# EAGLE schematic barrieren-a-2 (EAGLE 9.6.2)
AUTHOR: Balazs Racz; DRAWING_TITLE: MEB Schalterwerk Projekt; LICENSE: Licensed by the Solderpad Hardware License V2.0; REVIEWER: n/a; REVISION: A5; YEAR: 2023
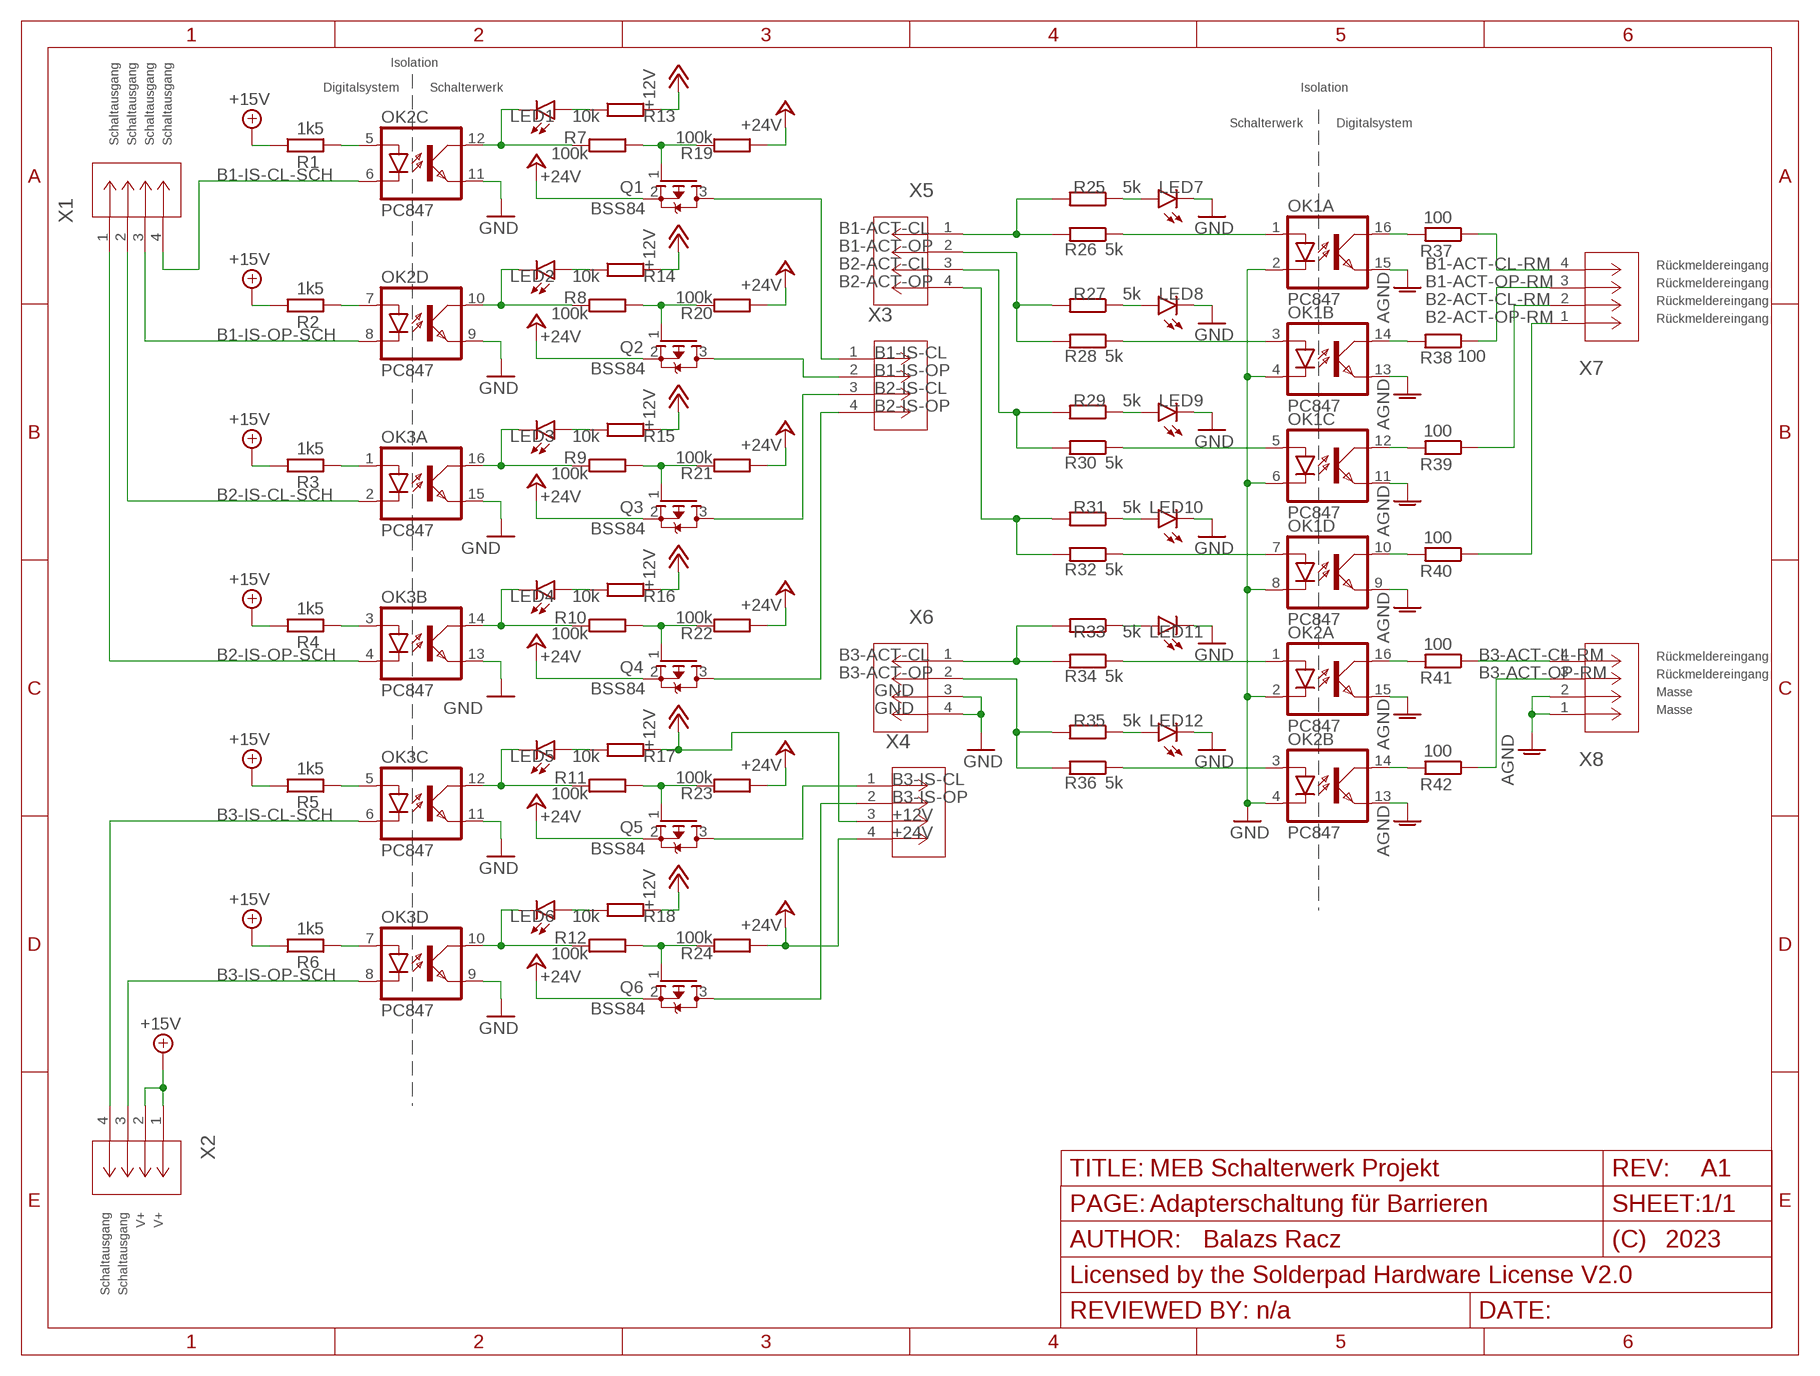
[diagram p0: schematic, sheet 1]
FRAME1 (FRAME_A_L): PAGE: Input ports
FRAME2 (FRAME_A_L): PAGE: Adapterschaltung für Barrieren; REVISION: A1

## Parts
LED1  LEDCHIPLED_0603  [CHIPLED_0603]
LED2  LEDCHIPLED_0603  [CHIPLED_0603]
LED3  LEDCHIPLED_0603  [CHIPLED_0603]
LED4  LEDCHIPLED_0603  [CHIPLED_0603]
LED5  LEDCHIPLED_0603  [CHIPLED_0603]
LED6  LEDCHIPLED_0603  [CHIPLED_0603]
LED7  LEDCHIPLED_0603  [CHIPLED_0603]
LED8  LEDCHIPLED_0603  [CHIPLED_0603]
LED9  LEDCHIPLED_0603  [CHIPLED_0603]
LED10  LEDCHIPLED_0603  [CHIPLED_0603]
LED11  LEDCHIPLED_0603  [CHIPLED_0603]
LED12  LEDCHIPLED_0603  [CHIPLED_0603]
OK1  PC847  [DIL16]
OK2  PC847  [DIL16]
OK3  PC847  [DIL16]
Q1  BSS84  [SOT23-PCH]
Q2  BSS84  [SOT23-PCH]
Q3  BSS84  [SOT23-PCH]
Q4  BSS84  [SOT23-PCH]
Q5  BSS84  [SOT23-PCH]
Q6  BSS84  [SOT23-PCH]
R1  1k5  R-EU_R0805  [R0805]
R2  1k5  R-EU_R0805  [R0805]
R3  1k5  R-EU_R0805  [R0805]
R4  1k5  R-EU_R0805  [R0805]
R5  1k5  R-EU_R0805  [R0805]
R6  1k5  R-EU_R0805  [R0805]
R7  100k  R-EU_R0805  [R0805]
R8  100k  R-EU_R0805  [R0805]
R9  100k  R-EU_R0805  [R0805]
R10  100k  R-EU_R0805  [R0805]
R11  100k  R-EU_R0805  [R0805]
R12  100k  R-EU_R0805  [R0805]
R13  10k  R-EU_R0805  [R0805]
R14  10k  R-EU_R0805  [R0805]
R15  10k  R-EU_R0805  [R0805]
R16  10k  R-EU_R0805  [R0805]
R17  10k  R-EU_R0805  [R0805]
R18  10k  R-EU_R0805  [R0805]
R19  100k  R-EU_R0805  [R0805]
R20  100k  R-EU_R0805  [R0805]
R21  100k  R-EU_R0805  [R0805]
R22  100k  R-EU_R0805  [R0805]
R23  100k  R-EU_R0805  [R0805]
R24  100k  R-EU_R0805  [R0805]
R25  5k  R-EU_R0805  [R0805]
R26  5k  R-EU_R0805  [R0805]
R27  5k  R-EU_R0805  [R0805]
R28  5k  R-EU_R0805  [R0805]
R29  5k  R-EU_R0805  [R0805]
R30  5k  R-EU_R0805  [R0805]
R31  5k  R-EU_R0805  [R0805]
R32  5k  R-EU_R0805  [R0805]
R33  5k  R-EU_R0805  [R0805]
R34  5k  R-EU_R0805  [R0805]
R35  5k  R-EU_R0805  [R0805]
R36  5k  R-EU_R0805  [R0805]
R37  100  R-EU_R0805  [R0805]
R38  100  R-EU_R0805  [R0805]
R39  100  R-EU_R0805  [R0805]
R40  100  R-EU_R0805  [R0805]
R41  100  R-EU_R0805  [R0805]
R42  100  R-EU_R0805  [R0805]
X1  PHNX_4P_350CONN_1984989_PXC  [PHNX_4P_350]
X2  PHNX_4P_350CONN_1984989_PXC  [PHNX_4P_350]
X3  PHNX_4P_350CONN_1984989_PXC  [PHNX_4P_350]
X4  PHNX_4P_350CONN_1984989_PXC  [PHNX_4P_350]
X5  PHNX_4P_350CONN_1984989_PXC  [PHNX_4P_350]
X6  PHNX_4P_350CONN_1984989_PXC  [PHNX_4P_350]
X7  PHNX_4P_350CONN_1984989_PXC  [PHNX_4P_350]
X8  PHNX_4P_350CONN_1984989_PXC  [PHNX_4P_350]

## Nets
+12V: R13.2 R14.2 R15.2 R16.2 R17.2 R18.2 X4.3
+15V: R1.1 R2.1 R3.1 R4.1 R5.1 R6.1 X2.1 X2.2
+24V: Q1.2(S) Q2.2(S) Q3.2(S) Q4.2(S) Q5.2(S) Q6.2(S) R19.2 R20.2 R21.2 R22.2 R23.2 R24.2 X4.4
AGND: OK1.9(D:EMIT) OK1.11(C:EMIT) OK1.13(B:EMIT) OK1.15(A:EMIT) OK2.13(B:EMIT) OK2.15(A:EMIT) X8.1 X8.2
B1-ACT-CL: R25.2 R26.2 X5.1
B1-ACT-CL-RM: R37.1 X7.4
B1-ACT-OP: R27.2 R28.2 X5.2
B1-ACT-OP-RM: R38.1 X7.3
B1-IS-CL: Q1.3(D) X3.1
B1-IS-CL-SCH: OK2.6(C:C) X1.4
B1-IS-OP: Q2.3(D) X3.2
B1-IS-OP-SCH: OK2.8(D:C) X1.3
B2-ACT-CL: R29.2 R30.2 X5.3
B2-ACT-CL-RM: R39.1 X7.2
B2-ACT-OP: R31.2 R32.2 X5.4
B2-ACT-OP-RM: R40.1 X7.1
B2-IS-CL: Q3.3(D) X3.3
B2-IS-CL-SCH: OK3.2(A:C) X1.2
B2-IS-OP: Q4.3(D) X3.4
B2-IS-OP-SCH: OK3.4(B:C) X1.1
B3-ACT-CL: R33.2 R34.2 X6.1
B3-ACT-CL-RM: R41.1 X8.4
B3-ACT-OP: R35.2 R36.2 X6.2
B3-ACT-OP-RM: R42.1 X8.3
B3-IS-CL: Q5.3(D) X4.1
B3-IS-CL-SCH: OK3.6(C:C) X2.4
B3-IS-OP: Q6.3(D) X4.2
B3-IS-OP-SCH: OK3.8(D:C) X2.3
GND: LED7.C LED8.C LED9.C LED10.C LED11.C LED12.C OK1.2(A:C) OK1.4(B:C) OK1.6(C:C) OK1.8(D:C) OK2.2(A:C) OK2.4(B:C) OK2.9(D:EMIT) OK2.11(C:EMIT) OK3.9(D:EMIT) OK3.11(C:EMIT) OK3.13(B:EMIT) OK3.15(A:EMIT) X6.3 X6.4
N$1: Q1.1(G) R7.1 R19.1
N$2: OK2.1(A:A) R34.1
N$3: LED12.A R35.1
N$4: LED11.A R33.1
N$5: OK2.5(C:A) R1.2
N$6: OK1.12(C:COL) R39.2
N$7: OK2.3(B:A) R36.1
N$8: OK2.7(D:A) R2.2
N$9: OK1.10(D:COL) R40.2
N$10: OK1.5(C:A) R30.1
N$11: LED1.A R13.1
N$12: LED2.A R14.1
N$13: LED2.C OK2.10(D:COL) R8.2
N$14: Q2.1(G) R8.1 R20.1
N$15: OK3.1(A:A) R3.2
N$16: OK1.7(D:A) R32.1
N$17: LED9.A R29.1
N$18: LED3.A R15.1
N$19: OK2.16(A:COL) R41.2
N$20: LED3.C OK3.16(A:COL) R9.2
N$21: OK2.14(B:COL) R42.2
N$22: Q3.1(G) R9.1 R21.1
N$23: OK3.3(B:A) R4.2
N$24: LED10.A R31.1
N$29: LED4.A R16.1
N$30: OK1.16(A:COL) R37.2
N$31: LED1.C OK2.12(C:COL) R7.2
N$32: OK1.14(B:COL) R38.2
N$33: OK1.1(A:A) R26.1
N$34: LED4.C OK3.14(B:COL) R10.2
N$35: OK1.3(B:A) R28.1
N$36: LED7.A R25.1
N$37: LED8.A R27.1
N$40: Q4.1(G) R10.1 R22.1
N$41: OK3.5(C:A) R5.2
N$42: LED5.A R17.1
N$43: LED5.C OK3.12(C:COL) R11.2
N$44: Q5.1(G) R11.1 R23.1
N$45: OK3.7(D:A) R6.2
N$46: LED6.A R18.1
N$47: LED6.C OK3.10(D:COL) R12.2
N$48: Q6.1(G) R12.1 R24.1

## Notes on the sheet
- Isolation
- Digitalsystem | Schalterwerk | Isolation
- Schalterwerk | Digitalsystem
- Schaltausgang | Schaltausgang | Schaltausgang | Schaltausgang
- Rückmeldereingang
- Rückmeldereingang
- Rückmeldereingang
- Rückmeldereingang
- Rückmeldereingang
- Rückmeldereingang
- Masse
- Masse
- Schaltausgang | Schaltausgang | V+ | V+

## Library data of the parts
LED1-LED12 = led:LED: LED OSRAM: - CHIPLED LG R971, LG N971, LY N971, LG Q971, LY Q971, LO R971, LY R971 LH N974, LH R974 LS Q976, LO Q976, LY Q976 LO Q996 - Hyper CHIPLED LW Q18S LB Q993, LB Q99A, LB R99A - SideLED LS A670, LO A670, LY A670, LG A670, LP A670 LB A673, LV A673, LT A673, LW A673 LH A674 LY A675 LS A676, LA A676, LO A676, LY A676, LW A676 LS A679, LY A679, LG A679 - Hyper Micro SIDELED® LS Y876, LA Y876, LO Y876, LY Y876 LT Y87S - SmartLED LW L88C, LW L88S LB L89C, LB L89S, LG L890 LS L89K, LO L89K, LY L89K LS L896, LA L896, LO L896, LY L896 - TOPLED LS T670, LO T670, LY T670, LG T670, LP T670 LSG T670, LSP T670, LSY T670, LOP T670, LYG T670 LG T671, LOG T671, LSG T671 LB T673, LV T673, LT T673, LW T673 LH T674 LS T676, LA T676, LO T676, LY T676, LB T676, LH T676, LSB T676, LW T676 LB T67C, LV T67C, LT T67C, LS T67K, LO T67K, LY T67K, LW E67C LS E67B, LA E67B, LO E67B, LY E67B, LB E67C, LV E67C, LT E67C LW T67C LS T679, LY T679, LG T679 LS T770, LO T770, LY T770, LG T770, LP T770 LB T773, LV T773, LT T773, LW T773 LH T774 LS E675, LA E675, LY E675, LS T675 LS T776, LA T776, LO T776, LY T776, LB T776 LHGB T686 LT T68C, LB T68C - Hyper Mini TOPLED® LB M676 - Mini TOPLED Santana® LG M470 LS M47K, LO M47K, LY M47K Source: http://www.osram.convergy.de LUXEON: - LUMILED® LXK2-PW12-R00, LXK2-PW12-S00, LXK2-PW14-U00, LXK2-PW14-V00 LXK2-PM12-R00, LXK2-PM12-S00, LXK2-PM14-U00 LXK2-PE12-Q00, LXK2-PE12-R00, LXK2-PE12-S00, LXK2-PE14-T00, LXK2-PE14-U00 LXK2-PB12-K00, LXK2-PB12-L00, LXK2-PB12-M00, LXK2-PB14-N00, LXK2-PB14-P00, LXK2-PB14-Q00 LXK2-PR12-L00, LXK2-PR12-M00, LXK2-PR14-Q00, LXK2-PR14-R00 LXK2-PD12-Q00, LXK2-PD12-R00, LXK2-PD12-S00 LXK2-PH12-R00, LXK2-PH12-S00 LXK2-PL12-P00, LXK2-PL12-Q00, LXK2-PL12-R00 Source: www.luxeon.com KINGBRIGHT: KA-3528ASYC Source: www.kingbright.com
OK1-OK3 = optocoupler:PC847: SHARP OPTO COUPLER; OC_FARNELL: 9707735; OC_NEWARK: unknown
Q1-Q6 = eagleparts:BSS84: P-CHANNEL MOS FET
R1-R42 = rcl:R-EU_: RESISTOR, European symbol; SPICEPREFIX: R
X1-X8 = eagleparts:PHNX_4P_350: https://www.digikey.com/en/products/detail/phoenix-contact/1984989/2513979 DigiKey 277-6404-ND; COPYRIGHT: Copyright (C) 2023 Ultra Librarian. All rights reserved.; MANUFACTURER_PART_NUMBER: 1984989; MFR_NAME: Phoenix Contact